# Altium project TX2_PowerBoard.PrjPCB
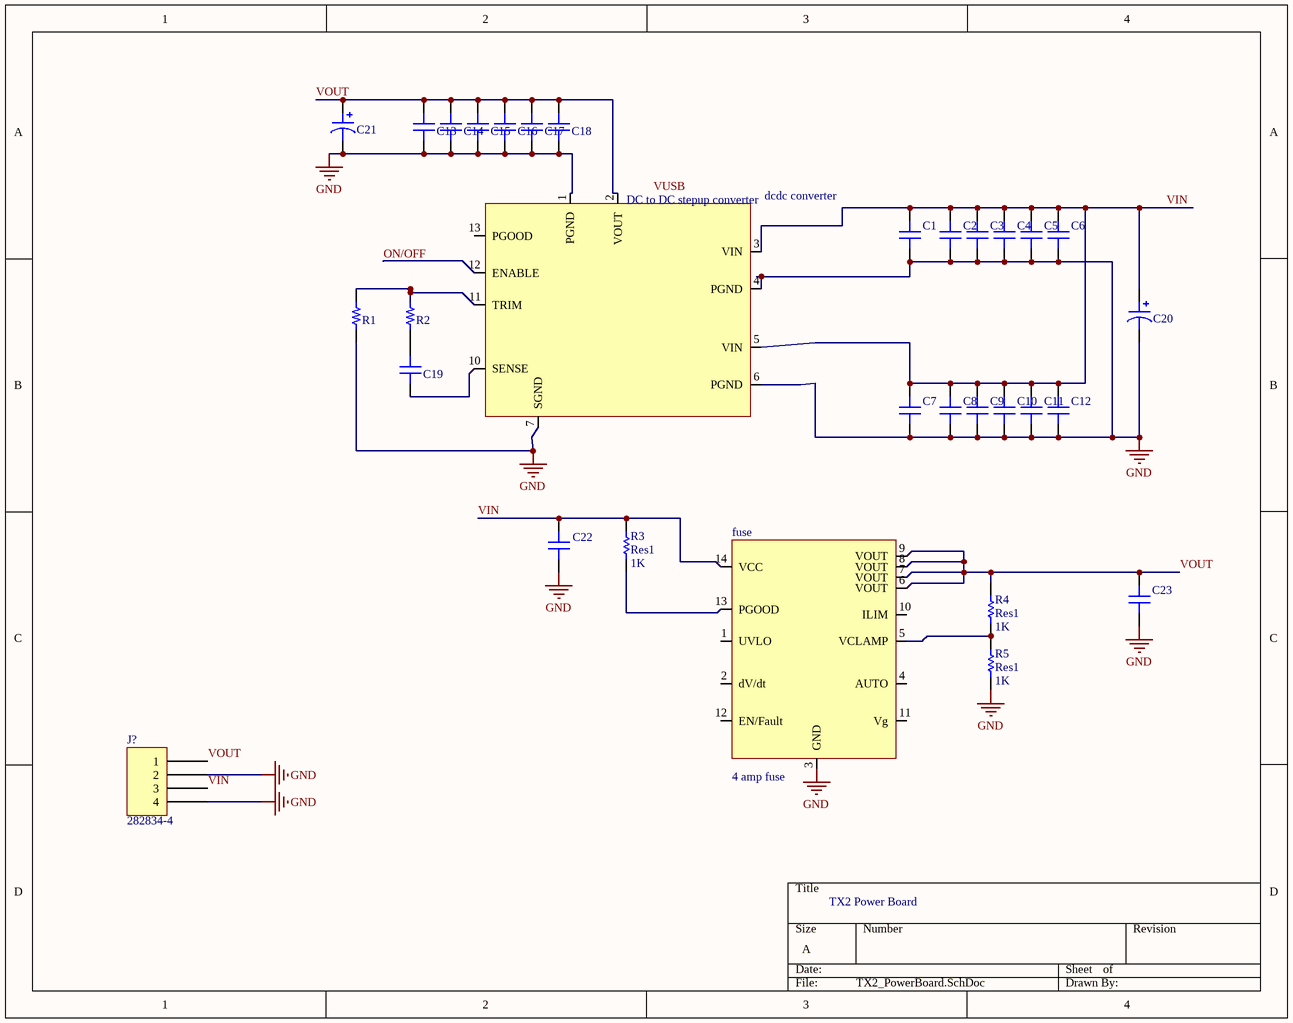
[diagram p0: TX2_PowerBoard.SchDoc]
1 sheet, 31 parts. Net scope: global (net labels, ports and power ports of the same name join across sheets).
Board file: TX2_PowerBoard.PcbDoc

## Sheet TX2_PowerBoard.SchDoc
size A

### Parts
C1  0.047uF  [CAP 0603/1608]  (value not drawn)
C2  4.7uF  [CAP 1210/3225 - 2.2MM]  (value not drawn)
C3  4.7uF  [CAP 1210/3225 - 2.2MM]  (value not drawn)
C4  4.7uF  [CAP 1210/3225 - 2.2MM]  (value not drawn)
C5  4.7uF  [CAP 1210/3225 - 2.2MM]  (value not drawn)
C6  4.7uF  [CAP 1210/3225 - 2.2MM]  (value not drawn)
C7  0.047uF  [CAP 0603/1608]  (value not drawn)
C8  4.7uF  [CAP 1210/3225 - 2.2MM]  (value not drawn)
C9  4.7uF  [CAP 1210/3225 - 2.2MM]  (value not drawn)
C10  4.7uF  [CAP 1210/3225 - 2.2MM]  (value not drawn)
C11  4.7uF  [CAP 1210/3225 - 2.2MM]  (value not drawn)
C12  4.7uF  [CAP 1210/3225 - 2.2MM]  (value not drawn)
C13  4.7uF  [CAP 1210/3225 - 2.8MM]  (value not drawn)
C14  4.7uF  [CAP 1210/3225 - 2.8MM]  (value not drawn)
C15  4.7uF  [CAP 1210/3225 - 2.8MM]  (value not drawn)
C16  4.7uF  [CAP 1210/3225 - 2.8MM]  (value not drawn)
C17  4.7uF  [CAP 1210/3225 - 2.8MM]  (value not drawn)
C18  4.7uF  [CAP 1210/3225 - 2.8MM]  (value not drawn)
C19  470pF  [CAP 0603/1608]  (value not drawn)
C20  470uF  [CAP ALUM 10.3MM]  (value not drawn)
C21  470uF  [CAP ALUM 10.3MM]  (value not drawn)
C22  4.7uF  [CAP 1210/3225 - 2.2MM]  (value not drawn)
C23  4.7uF  [CAP 1210/3225 - 2.2MM]  (value not drawn)
dcdc_converter  DC to DC stepup converter  [ABXS005S4X341-SRZ]
fuse  4 amp fuse  [TSSOP-14]
J?  282834-4  [TE 282834-4]
R1  13.7k  [RES 0603/1608]  (value not drawn)
R2  200k  [RES 0603/1608]  (value not drawn)
R3  Res1  value 1K  [AXIAL-0.3]
R4  Res1  value 1K  [AXIAL-0.3]
R5  Res1  value 1K  [AXIAL-0.3]

### Nets
GND: C1.2 C2.1 C3.1 C4.1 C5.1 C6.1 C7.2 C8.1 C9.1 C10.1 C11.1 C12.1 C13.1 C14.1 C15.1 C16.1 C17.1 C18.1 C20.2 C21.2 C22.1 C23.1 dcdc_converter.1(PGND) dcdc_converter.4(PGND) dcdc_converter.6(PGND) dcdc_converter.7(SGND) fuse.3(GND) J?.2 J?.4 R1.1 R5.1
ON/OFF: dcdc_converter.12(ENABLE)
VIN: C1.1 C2.2 C3.2 C4.2 C5.2 C6.2 C7.1 C8.2 C9.2 C10.2 C11.2 C12.2 C20.1 C22.2 dcdc_converter.3(VIN) dcdc_converter.5(VIN) fuse.14(VCC) J?.3 R3.2
VOUT: C13.2 C14.2 C15.2 C16.2 C17.2 C18.2 C21.1 C23.2 dcdc_converter.2(VOUT) fuse.6(VOUT) fuse.7(VOUT) fuse.8(VOUT) fuse.9(VOUT) J?.1 R4.2
NetC19_1: C19.1 dcdc_converter.10(SENSE)
NetC19_2: C19.2 R2.1
Netdcdc_converter_11: dcdc_converter.11(TRIM) R1.2 R2.2
Netfuse_5: fuse.5(VCLAMP) R4.1 R5.2
Netfuse_13: fuse.13(PGOOD) R3.1

Not connected (* = marked no-connect by the designer): dcdc_converter 13(PGOOD); fuse 1(UVLO) 2(dV/dt) 4(AUTO) 10(ILIM) 11(Vg) 12(EN/Fault)

### Notes on the sheet
- TX2 Power Board
- Labels drawn without touching a wire or pin: VUSB

### Library data of the parts
C1 C7 = GCM188R71H473KA55D: CAP CER 0.047UF 50V X7R 0603; Manufacturer: Murata Electronics North America; TemperatureRange: -55C ~ 125C; Tolerance: 10%; Value: 0.047uF; Part Number: GCM188R71H473KA55D; PartId: 12944; Supplier 1: Digi-Key; Supplier Part Number 1: 490-4934-2-ND; ComponentLink1Description: Datasheet; ComponentLink1URL: http://www.murata.com/~/media/webrenewal/support/library/catalog/products/capacitor/mlcc/c03e.ashx; ComponentLink2Description: Digi-Key Listing; ComponentLink2URL: https://www.digikey.com/product-detail/en/murata-electronics-north-america/GCM188R71H473KA55D/490-4934-2-ND/1765182; TemperatureCoefficient: X7R; Voltage: 50V; Price: 0.0193; Device Package: 0603 (1608 Metric)
C2-C6 C8-C12 C22 C23 = GCM32DR71E475KA55L: CAP CER 4.7UF 25V X7R 1210; Manufacturer: Murata Electronics North America; TemperatureRange: -55C ~ 125C; Tolerance: 10%; Value: 4.7uF; Part Number: GCM32DR71E475KA55L; PartId: 18697; Supplier 1: Digi-Key; Supplier Part Number 1: 490-8063-2-ND; ComponentLink1Description: Datasheet; ComponentLink1URL: http://www.murata.com/~/media/webrenewal/support/library/catalog/products/capacitor/mlcc/c03e.ashx; ComponentLink2Description: Digi-Key Listing; ComponentLink2URL: https://www.digikey.com/product-detail/en/murata-electronics-north-america/GCM32DR71E475KA55L/490-8063-2-ND/2592481; TemperatureCoefficient: X7R; Voltage: 25V; Price: 0.428; Device Package: 1210 (3225 Metric)
C13-C18 = GCM32ER71H475KA55K: CAP CER 4.7UF 50V X7R 1210; Manufacturer: Murata Electronics North America; TemperatureRange: -55C ~ 125C; Tolerance: 10%; Value: 4.7uF; Part Number: GCM32ER71H475KA55K; PartId: 19150; Supplier 1: Digi-Key; Supplier Part Number 1: 490-8066-2-ND; ComponentLink1Description: Datasheet; ComponentLink1URL: http://www.murata.com/~/media/webrenewal/support/library/catalog/products/capacitor/mlcc/c03e.ashx; ComponentLink2Description: Digi-Key Listing; ComponentLink2URL: https://www.digikey.com/product-detail/en/murata-electronics-north-america/GCM32ER71H475KA55K/490-8066-2-ND/2592491; TemperatureCoefficient: X7R; Voltage: 50V; Price: 0.6447; Device Package: 1210 (3225 Metric)
C19 = GCM1885C2A471JA16D: CAP CER 470PF 100V NP0 0603; Manufacturer: Murata Electronics North America; TemperatureRange: -55C ~ 125C; TemperatureCoefficient: C0G, NP0; Tolerance: 5%; Value: 470pF; Part Number: GCM1885C2A471JA16D; PartId: 13595; Supplier 1: Digi-Key; Supplier Part Number 1: 490-4949-2-ND; ComponentLink1Description: Datasheet; ComponentLink1URL: http://www.murata.com/~/media/webrenewal/support/library/catalog/products/capacitor/mlcc/c03e.ashx; ComponentLink2Description: Digi-Key Listing; ComponentLink2URL: https://www.digikey.com/product-detail/en/murata-electronics-north-america/GCM1885C2A471JA16D/490-4949-2-ND/1765197; Voltage: 100V; Price: 0.0279; Device Package: 0603 (1608 Metric)
C20 = EEE-1EA471P: CAP ALUM 470UF 20% 25V SMD; Manufacturer: Panasonic Electronic Components; TemperatureRange: -40C ~ 85C; Type: Automotive; Ripple Current: 380mA; Lifetime @ Temp: 2000 Hrs @ 85C; Value: 470uF; Part Number: EEE-1EA471P; PartId: 7417; Supplier 1: Digi-Key; Supplier Part Number 1: PCE3909TR-ND; ComponentLink1Description: Datasheet; ComponentLink1URL: http://media.digikey.com/pdf/Data%20Sheets/Panasonic%20Electronic%20Components/S_Series_Type_V.pdf; ComponentLink2Description: Digi-Key listing; ComponentLink2URL: http://digikey.com/product-detail/en/EEE-1EA471P/PCE3909TR-ND/766076; Tolerance: 20%; Voltage: 25V; Price: 0.3451; Device Package: Radial, Can - SMD; Impedance: -
C21 = EEE-1EA471UAP: CAP ALUM 470UF 20% 25V SMD; Manufacturer: Panasonic Electronic Components; TemperatureRange: -40C ~ 85C; Type: High Temperature Reflow; Ripple Current: 380mA; Lifetime @ Temp: 1000 Hrs @ 85C; Value: 470uF; Part Number: EEE-1EA471UAP; PartId: 7429; Supplier 1: Digi-Key; Supplier Part Number 1: PCE4605TR-ND; ComponentLink1Description: Datasheet; ComponentLink1URL: http://media.digikey.com/pdf/Data%20Sheets/Panasonic%20Electronic%20Components/S_Series_Type_V.pdf; ComponentLink2Description: Digi-Key listing; ComponentLink2URL: http://digikey.com/product-detail/en/EEE-1EA471UAP/PCE4605TR-ND/1717771; Tolerance: 20%; Voltage: 25V; Price: 0.3725; Device Package: Radial, Can - SMD; Impedance: -
dcdc_converter = ABXS005S4X341-SRZ
fuse = TSSOP-14
J? = 282834-4: TERM BLOCK 4POS SIDE ENT 2.54MM; Part Number: 282834-4
R1 = ERJ-3EKF1372V: RES SMD 13.7K OHM 1% 1/10W 0603; Manufacturer: Panasonic Electronic Components; TemperatureRange: -55C ~ 155C; TemperatureCoefficient: 100ppm/C; PowerRating: 0.1W, 1/10W; Value: 13.7k; Part Number: ERJ-3EKF1372V; PartId: 1167; Supplier 1: Digi-Key; Supplier Part Number 1: P13.7KHTR-ND; ComponentLink1Description: Datasheet; ComponentLink1URL: http://industrial.panasonic.com/www-cgi/jvcr13pz.cgi?E+PZ+3+AOA0002+ERJ3EKF1372V+7+WW; ComponentLink2Description: Digi-Key listing; ComponentLink2URL: http://digikey.com/product-detail/en/ERJ-3EKF1372V/P13.7KHTR-ND/196114; Tolerance: 1%; Price: 0.0038; Type: Thick Film; Device Package: 0603 (1608 Metric)
R2 = ERJ-3EKF2003V: RES SMD 200K OHM 1% 1/10W 0603; Manufacturer: Panasonic Electronic Components; TemperatureRange: -55C ~ 155C; TemperatureCoefficient: 100ppm/C; PowerRating: 0.1W, 1/10W; Value: 200k; Part Number: ERJ-3EKF2003V; PartId: 906; Supplier 1: Digi-Key; Supplier Part Number 1: P200KHTR-ND; ComponentLink1Description: Datasheet; ComponentLink1URL: http://industrial.panasonic.com/www-cgi/jvcr13pz.cgi?E+PZ+3+AOA0002+ERJ3EKF2003V+7+WW; ComponentLink2Description: Digi-Key listing; ComponentLink2URL: http://digikey.com/product-detail/en/ERJ-3EKF2003V/P200KHTR-ND/196206; Tolerance: 1%; Price: 0.0038; Type: Thick Film; Device Package: 0603 (1608 Metric)
R3-R5 = Res1: Resistor; Published: 8-Jun-2000; LatestRevisionDate: 17-Jul-2002; LatestRevisionNote: Re-released for DXP Platform.; PackageReference: AXIAL-0.3; Publisher: Altium Limited; PackageDescription: Axial Device, Thru-Hole; 2 Leads; 0.3 in Pin Spacing